# EAGLE design dual_encoder_shield_3v_reve (EAGLE 9.6.2)
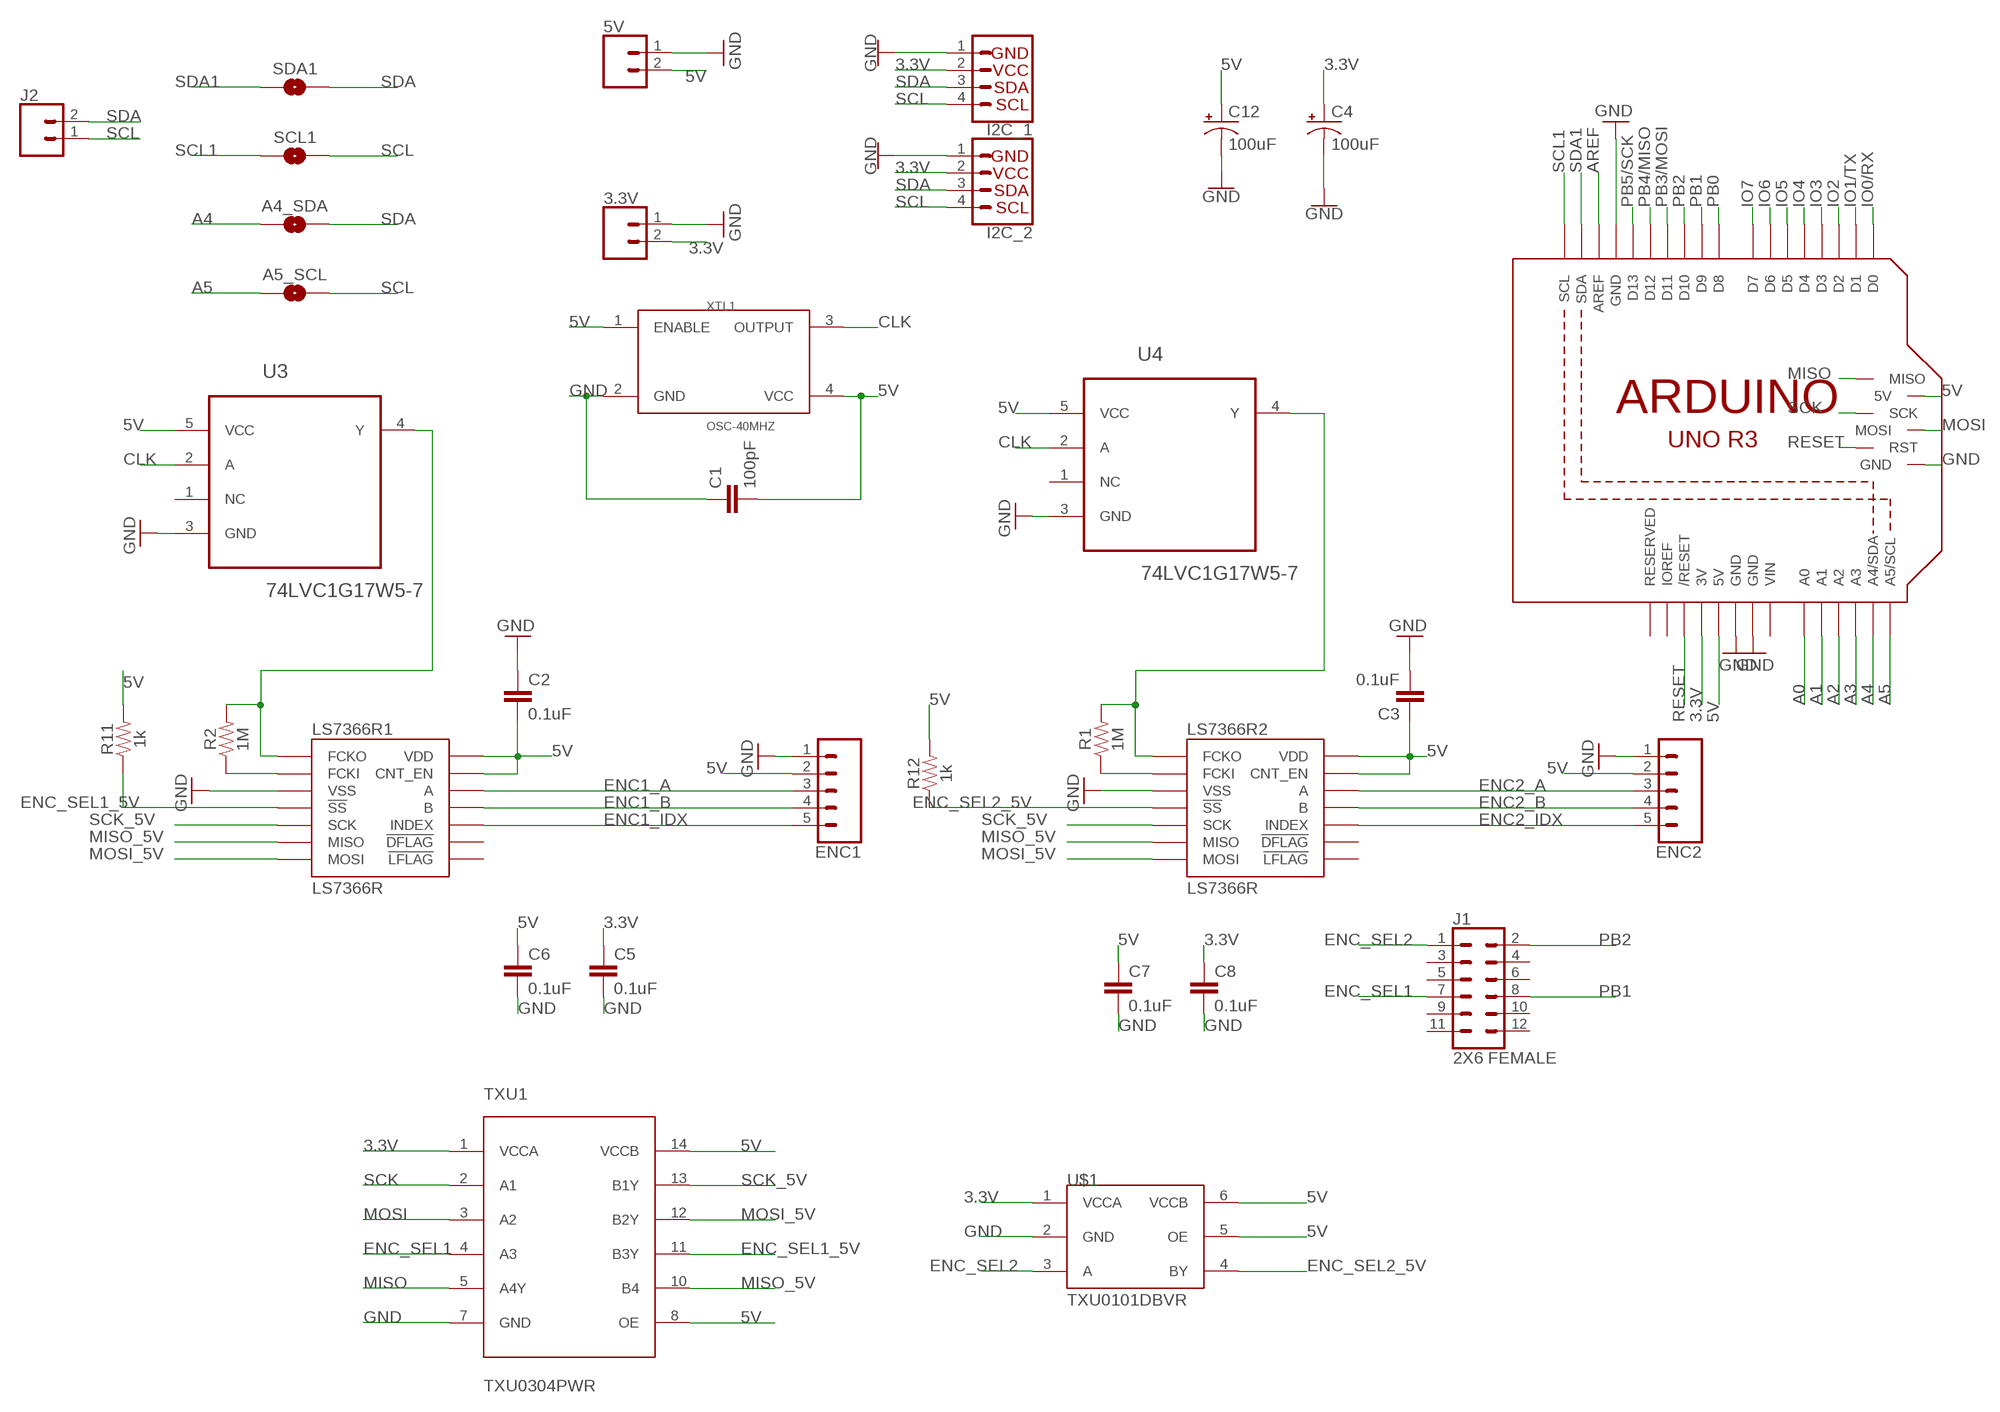
[diagram p0: schematic, sheet 1]

## Parts
3.3V  CONN_02-JST-2MM-SMT  [JST-2-SMD]
5V  CONN_02-JST-2MM-SMT  [JST-2-SMD]
A4_SDA  JUMPER-SMT_2_NO_NO-SILK  [SMT-JUMPER_2_NO_NO-SILK]
A5_SCL  JUMPER-SMT_2_NO_NO-SILK  [SMT-JUMPER_2_NO_NO-SILK]
C1  100pF  100PF-0603-50V-5%  [0603]
C2  0.1uF  0.1UF-0603-25V-5%  [0603]
C3  0.1uF  0.1UF-0603-25V-5%  [0603]
C4  100uF  100UF-POLAR-25V-20%(ELEC)  [PANASONIC_D]
C5  0.1uF  0.1UF-0603-25V-5%  [0603]
C6  0.1uF  0.1UF-0603-25V-5%  [0603]
C7  0.1uF  0.1UF-0603-25V-5%  [0603]
C8  0.1uF  0.1UF-0603-25V-5%  [0603]
C12  100uF  100UF-POLAR-25V-20%(ELEC)  [PANASONIC_D]
ENC1  CONN_05  [1X05]
ENC2  CONN_05  [1X05]
I2C_1  QWIIC_CONNECTORJS-1MM  [JST04_1MM_RA]
I2C_2  QWIIC_CONNECTORJS-1MM  [JST04_1MM_RA]
J1  2X6 FEMALE  CONN_06X2PTH_FEMALE  [2X6]
J2  CONN_02  [1X02]
LS7366R1  LS7366R  [SOIC14]
LS7366R2  LS7366R  [SOIC14]
M1  ARDUINO_R3_ICSP  [ARDUINOR3_ICSP]
R1  1M  1MOHM-0603-1/4W-5%  [0603]
R2  1M  1MOHM-0603-1/4W-5%  [0603]
R11  1k  1KOHM-0603-1/10W-1%  [0603]
R12  1k  1KOHM-0603-1/10W-1%  [0603]
SCL1  JUMPER-SMT_2_NO_NO-SILK  [SMT-JUMPER_2_NO_NO-SILK]
SDA1  JUMPER-SMT_2_NO_NO-SILK  [SMT-JUMPER_2_NO_NO-SILK]
TXU1  TXU0304PWR  [SOP65P640X95-14N]
U3  74LVC1G17W5-7  [SOT95P280X145-5N]
U4  74LVC1G17W5-7  [SOT95P280X145-5N]
U$1  TXU0101DBVR  [SOT23-6]
XTL1  OSC-40MHZ  [OSC_CB3LV-5I-50M000000]

## Nets
3.3V: 3.3V.2 C4.+ C5.1 C8.1 I2C_1.2 I2C_2.2 M1.3V TXU1.1(VCCA) U$1.1(VCCA)
5V: 5V.2 C1.2 C2.2 C3.1 C6.1 C7.1 C12.+ ENC1.2 ENC2.2 LS7366R1.13(CNT_EN) LS7366R1.14(VDD) LS7366R2.13(CNT_EN) LS7366R2.14(VDD) M1.5V M1.5V_ICSP(5V) R11.2 R12.2 TXU1.8(OE) TXU1.14(VCCB) U3.5(VCC) U4.5(VCC) U$1.5(OE) U$1.6(VCCB) XTL1.1(ENABLE) XTL1.4(VCC)
A0: M1.A0
A1: M1.A1
A2: M1.A2
A3: M1.A3
A4: A4_SDA.1 M1.A4(A4/SDA)
A5: A5_SCL.1 M1.A5(A5/SCL)
AREF: M1.AREF
CLK: U3.2(A) U4.2(A) XTL1.3(OUTPUT)
ENC1_A: ENC1.3 LS7366R1.12(A)
ENC1_B: ENC1.4 LS7366R1.11(B)
ENC1_IDX: ENC1.5 LS7366R1.10(INDEX)
ENC2_A: ENC2.3 LS7366R2.12(A)
ENC2_B: ENC2.4 LS7366R2.11(B)
ENC2_IDX: ENC2.5 LS7366R2.10(INDEX)
ENC_SEL1: J1.7 TXU1.4(A3)
ENC_SEL1_5V: LS7366R1.4(!SS) R11.1 TXU1.11(B3Y)
ENC_SEL2: J1.1 U$1.3(A)
ENC_SEL2_5V: LS7366R2.4(!SS) R12.1 U$1.4(BY)
GND: 3.3V.1 5V.1 C1.1 C2.1 C3.2 C4.- C5.2 C6.2 C7.2 C8.2 C12.- ENC1.1 ENC2.1 I2C_1.1 I2C_2.1 LS7366R1.3(VSS) LS7366R2.3(VSS) M1.GND M1.GND@1(GND) M1.GND@2(GND) M1.GND@3(GND) TXU1.7(GND) U3.3(GND) U4.3(GND) U$1.2(GND) XTL1.2(GND)
IO0/RX: M1.D0
IO1/TX: M1.D1
IO2: M1.D2
IO3: M1.D3
IO4: M1.D4
IO5: M1.D5
IO6: M1.D6
IO7: M1.D7
MISO: M1.MISO TXU1.5(A4Y)
MISO_5V: LS7366R1.6(MISO) LS7366R2.6(MISO) TXU1.10(B4)
MOSI: M1.MOSI TXU1.3(A2)
MOSI_5V: LS7366R1.7(MOSI) LS7366R2.7(MOSI) TXU1.12(B2Y)
N$6: LS7366R1.2(FCKI) R2.1
N$8: LS7366R2.1(FCKO) R1.2 U4.4(Y)
N$9: LS7366R2.2(FCKI) R1.1
N$10: LS7366R1.1(FCKO) R2.2 U3.4(Y)
PB0: M1.D8
PB1: J1.8 M1.D9
PB2: J1.2 M1.D10
PB3/MOSI: M1.D11
PB4/MISO: M1.D12
PB5/SCK: M1.D13
RESET: M1.RESET(/RESET) M1.RESET_ICSP(RST)
SCK: M1.SCK TXU1.2(A1)
SCK_5V: LS7366R1.5(SCK) LS7366R2.5(SCK) TXU1.13(B1Y)
SCL: A5_SCL.2 I2C_1.4 I2C_2.4 J2.1 SCL1.2
SCL1: M1.SCL SCL1.1
SDA: A4_SDA.2 I2C_1.3 I2C_2.3 J2.2 SDA1.2
SDA1: M1.SDA SDA1.1
Unconnected: J1.3 J1.4 J1.5 J1.6 J1.9 J1.10 J1.11 J1.12 LS7366R1.8(!LFLAG) LS7366R1.9(!DFLAG) LS7366R2.8(!LFLAG) LS7366R2.9(!DFLAG) M1.IOREF M1.RESERVED U3.1(NC) U4.1(NC)

## Power pins joined to a net without a drawn wire
VIN: M1.VIN

## Library data of the parts
3.3V 5V = SparkFun-Connectors:CONN_02: Multi connection point. Often used as Generic Header-pin footprint for 0.1 inch spaced/style header connections On any of the 0.1 inch spaced packages, you can populate with these: Break Away Headers - Straight <https://www.sparkfun.com/products/116> (PRT-00116) Break Away Male Headers - Right Angle <https://www.sparkfun.com/products/553> (PRT-00553) Female Headers <https://www.sparkfun.com/products/115> (PRT-00115) Break Away Headers - Machine Pin <https://www.sparkfun.com/products/117> (PRT-00117) Break Away Female Headers - Swiss Machine Pin <https://www.sparkfun.com/products/743> (PRT-00743) For SCREWTERMINALS and SPRING TERMINALS visit here: Screw Terimnals on SparkFun.com <https://www.sparkfun.com/search/results?term=Screw+Terminals> (5mm/3.5mm/2.54mm spacing) This device is also useful as a general connection point to wire up your design to another part of your project. Our various solder wires solder well into these plated through hole pads. Hook-Up Wire - Assortment (Stranded, 22 AWG) <https://www.sparkfun.com/products/11375> (PRT-11375) Hook-Up Wire - Assortment (Solid Core, 22 AWG) <https://www.sparkfun.com/products/11367> (PRT-11367) View the entire wire category on our website here <https://www.sparkfun.com/categories/141> Special notes: Molex polarized connector foot print use with: PRT-08233 with associated crimp pins and housings. 2.54_SCREWTERM for use with PRT-10571. 3.5mm Screw Terminal footprints for PRT-08084 5mm Screw Terminal footprints for use with PRT-08432; PROD_ID: CONN-11443
A4_SDA A5_SCL SCL1 SDA1 = SparkFun-Jumpers:JUMPER-SMT_2_NO: Normally open jumper This jumper has two pads in close proximity to each other. Apply solder to close the connection. Round pads are easier to solder for beginners, but are a lot larger. SparkFun Product that uses the round pads: SparkFun EL Sequencer <https://www.sparkfun.com/products/12781>
C1 = SparkFun-Capacitors:100PF: 100pF/0.1nF ceramic capacitors A capacitor is a passive two-terminal electrical component used to store electrical energy temporarily in an electric field.; PROD_ID: CAP-07883
C2 C3 C5-C8 = SparkFun-Capacitors:0.1UF: 0.1µF ceramic capacitors A capacitor is a passive two-terminal electrical component used to store electrical energy temporarily in an electric field.; PROD_ID: CAP-08604
C4 C12 = SparkFun-Capacitors:100UF-POLAR: 100µF polarized capacitors A capacitor is a passive two-terminal electrical component used to store electrical energy temporarily in an electric field.; PROD_ID: CAP-12547
ENC1 ENC2 = SparkFun-Connectors:CONN_05: Multi connection point. Often used as Generic Header-pin footprint for 0.1 inch spaced/style header connections On any of the 0.1 inch spaced packages, you can populate with these: Break Away Headers - Straight <https://www.sparkfun.com/products/116> (PRT-00116) Break Away Male Headers - Right Angle <https://www.sparkfun.com/products/553> (PRT-00553) Female Headers <https://www.sparkfun.com/products/115> (PRT-00115) Break Away Headers - Machine Pin <https://www.sparkfun.com/products/117> (PRT-00117) Break Away Female Headers - Swiss Machine Pin <https://www.sparkfun.com/products/743> (PRT-00743) For SCREWTERMINALS and SPRING TERMINALS visit here: Screw Terimnals on SparkFun.com <https://www.sparkfun.com/search/results?term=Screw+Terminals> (5mm/3.5mm/2.54mm spacing) This device is also useful as a general connection point to wire up your design to another part of your project. Our various solder wires solder well into these plated through hole pads. Hook-Up Wire - Assortment (Stranded, 22 AWG) <https://www.sparkfun.com/products/11375> (PRT-11375) Hook-Up Wire - Assortment (Solid Core, 22 AWG) <https://www.sparkfun.com/products/11367> (PRT-11367) View the entire wire category on our website here <https://www.sparkfun.com/categories/141> Special notes: Molex polarized connector foot print use with SKU : PRT-08231 with associated crimp pins and housings. 1MM SMD Version SKU: PRT-10208
I2C_1 I2C_2 = SparkFun-Connectors:QWIIC_CONNECTOR: SparkFun I2C Standard Qwiic Connector An SMD 1mm pitch JST connector makes it easy and quick (get it? Qwiic?) to connect I2C devices to each other. The Qwiic system <http://www.sparkfun.com/qwiic> enables fast and solderless connection between popular platforms and various sensors and actuators. We carry 200mm <https://www.sparkfun.com/products/14204>, 100mm <https://www.sparkfun.com/products/14205>, 50mm <https://www.sparkfun.com/products/14206>, and breadboard friendly <https://www.sparkfun.com/products/14207> Qwiic cables. We also offer 10 pcs strips <https://www.sparkfun.com/products/14323> the SMD connectors.; PROD_ID: CONN-13694
J1 = SparkFun-Connectors:CONN_06X2: Multi connection point. Often used as Generic Header-pin footprint for 0.1 inch spaced/style header connections On any of the 0.1 inch spaced packages, you can populate with these: Break Away Headers - Straight <https://www.sparkfun.com/products/116> (PRT-00116) Break Away Male Headers - Right Angle <https://www.sparkfun.com/products/553> (PRT-00553) Female Headers <https://www.sparkfun.com/products/115> (PRT-00115) Break Away Headers - Machine Pin <https://www.sparkfun.com/products/117> (PRT-00117) Break Away Female Headers - Swiss Machine Pin <https://www.sparkfun.com/products/743> (PRT-00743); PROD_ID: CONN-12423
J2 = SparkFun-Connectors:CONN_02: Multi connection point. Often used as Generic Header-pin footprint for 0.1 inch spaced/style header connections On any of the 0.1 inch spaced packages, you can populate with these: Break Away Headers - Straight <https://www.sparkfun.com/products/116> (PRT-00116) Break Away Male Headers - Right Angle <https://www.sparkfun.com/products/553> (PRT-00553) Female Headers <https://www.sparkfun.com/products/115> (PRT-00115) Break Away Headers - Machine Pin <https://www.sparkfun.com/products/117> (PRT-00117) Break Away Female Headers - Swiss Machine Pin <https://www.sparkfun.com/products/743> (PRT-00743) For SCREWTERMINALS and SPRING TERMINALS visit here: Screw Terimnals on SparkFun.com <https://www.sparkfun.com/search/results?term=Screw+Terminals> (5mm/3.5mm/2.54mm spacing) This device is also useful as a general connection point to wire up your design to another part of your project. Our various solder wires solder well into these plated through hole pads. Hook-Up Wire - Assortment (Stranded, 22 AWG) <https://www.sparkfun.com/products/11375> (PRT-11375) Hook-Up Wire - Assortment (Solid Core, 22 AWG) <https://www.sparkfun.com/products/11367> (PRT-11367) View the entire wire category on our website here <https://www.sparkfun.com/categories/141> Special notes: Molex polarized connector foot print use with: PRT-08233 with associated crimp pins and housings. 2.54_SCREWTERM for use with PRT-10571. 3.5mm Screw Terminal footprints for PRT-08084 5mm Screw Terminal footprints for use with PRT-08432
LS7366R1 LS7366R2 = LS7366R:LS7366R; AVAILABILITY: Unavailable; MF: LSI; MP: LS7366R; PACKAGE: None; PRICE: None
M1 = adafruit:ARDUINO_R3_ICSP
R1 R2 = SparkFun-Resistors:1MOHM: 1MΩ resistor A resistor is a passive two-terminal electrical component that implements electrical resistance as a circuit element. Resistors act to reduce current flow, and, at the same time, act to lower voltage levels within circuits. - Wikipedia; PROD_ID: RES-07868
R11 R12 = SparkFun-Resistors:1KOHM: 1kΩ resistor A resistor is a passive two-terminal electrical component that implements electrical resistance as a circuit element. Resistors act to reduce current flow, and, at the same time, act to lower voltage levels within circuits. - Wikipedia; PROD_ID: RES-07856
TXU1 = steveo:TXU0304PWR
U3 U4 = 74LVC1G17W5-7:74LVC1G17W5-7: SCHMITT-TRIGGER INVERETER; DESCRIPTION: Buffer, Non-Inverting 1 Element 1 Bit per Element Push-Pull Output SOT-25; DIGI-KEY_PART_NUMBER: 74LVC1G17W5-7TR-ND; MF: Diodes Inc.; MP: 74LVC1G17W5-7; PACKAGE: SOT-753 Diodes Inc.; PURCHASE-URL: https://pricing.snapeda.com/search/part/74LVC1G17W5-7/?ref=eda
U$1 = steveo:TXU0101DBVR
XTL1 = steveo:OSC-40MHZ

## Board
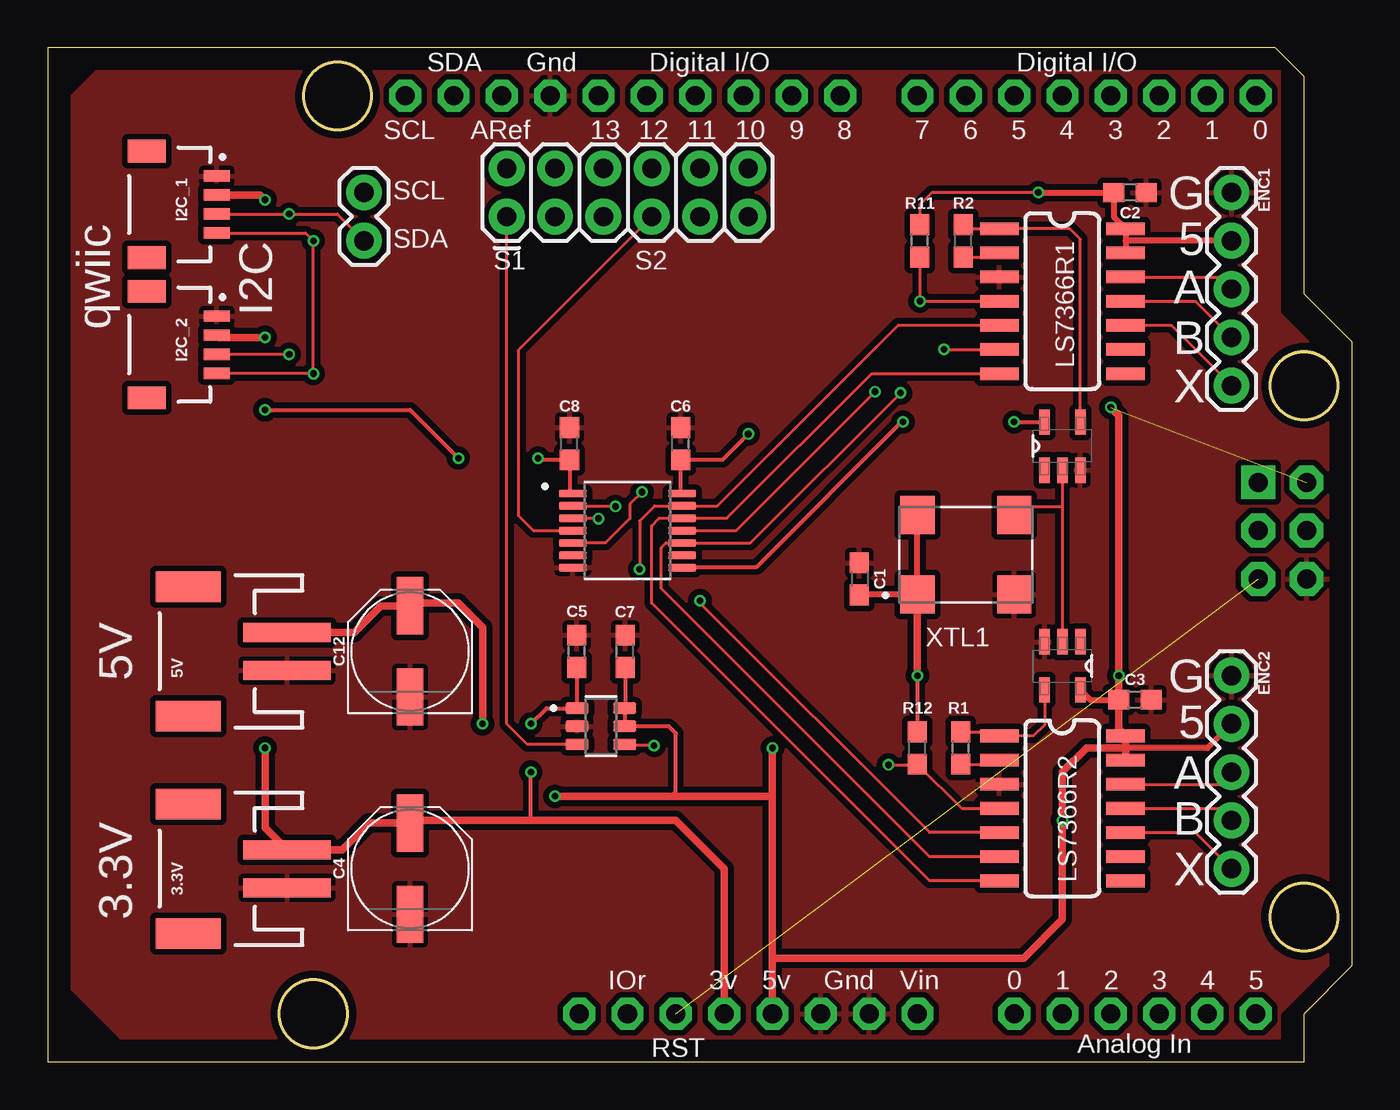
[diagram p1: board, top side]
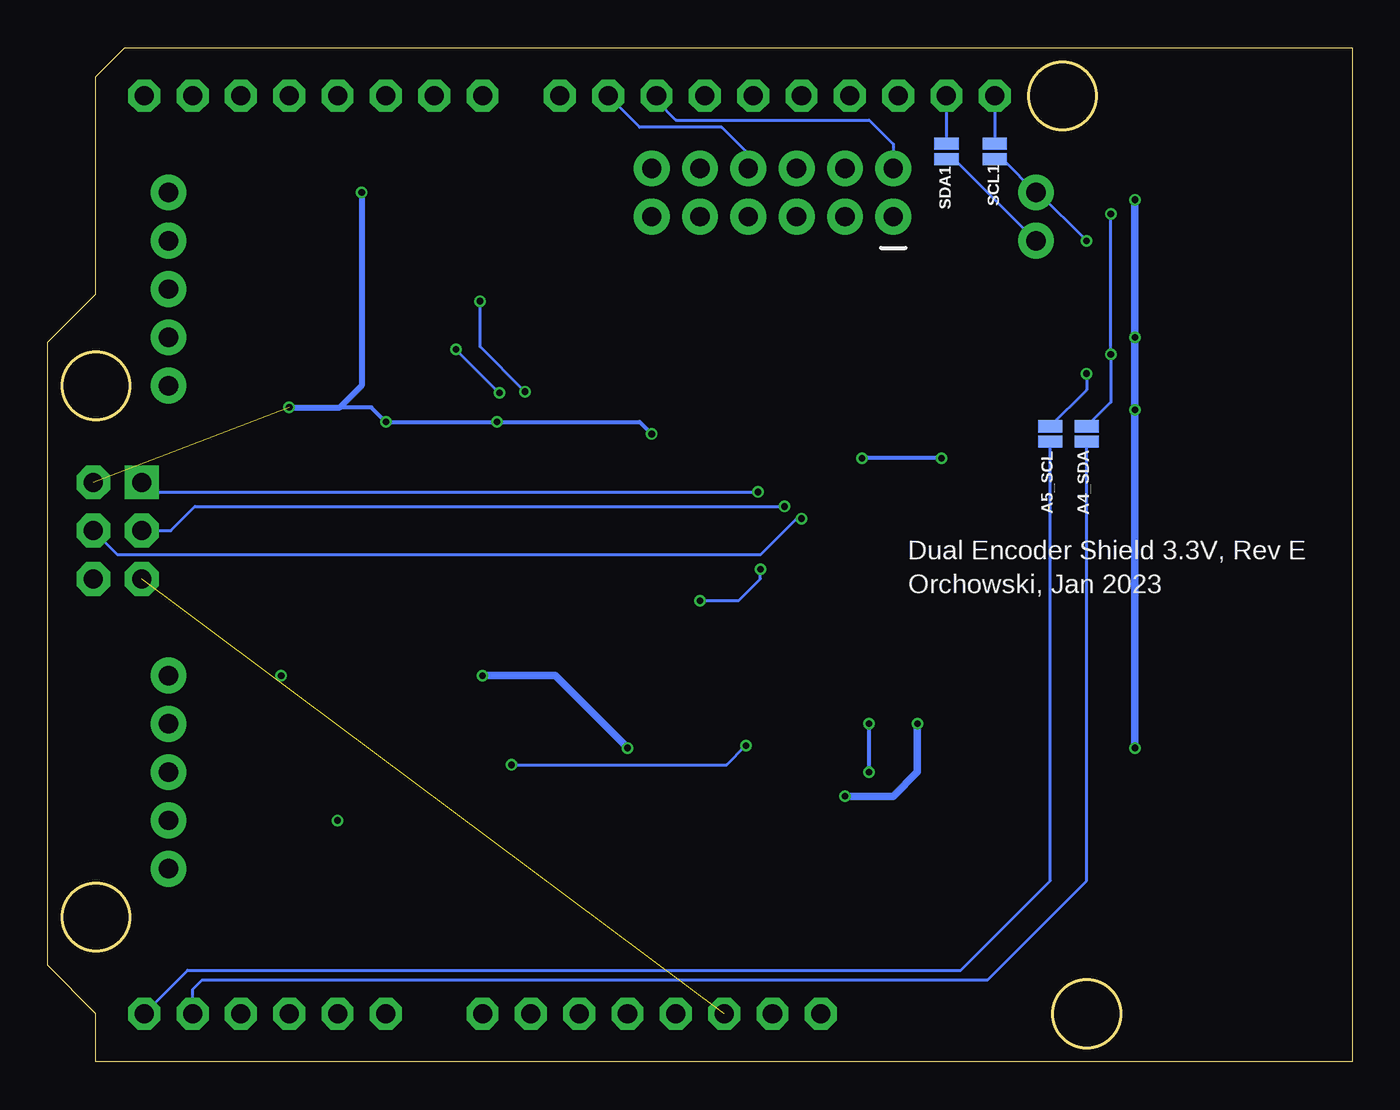
[diagram p2: board, bottom side, seen from below]

Size 55.65 x 51.82 mm. Coordinates in mm from the lower left corner, seen from the top.
Outline: circle at 3.07,50.06 radius 1.77
Outline: circle at 53.87,34.82 radius 1.78
Outline: circle at 53.87,6.88 radius 1.78
Outline: circle at 1.8,1.8 radius 1.8
Copper layers (1*16): Top 0.035559375mm / dielectric 1.6mm / Bottom 0.035559375mm
Design rules "oshpark-2layer": minimum track width 6mil, minimum drill 10mil, track to track 6mil, track to pad 6mil, pad to pad 6mil, via to via 6mil, smd to smd 6mil, copper to edge 15mil, drill to drill 6mil, minimum pad ring 5mil, minimum via ring 5mil, stop-mask expansion 2.5mil, vias tented up to drill 0mil, thermal gap 10mil

### Footprints (pad centres in the part's own frame; a part is rotated, then mirrored left to right if it is on the bottom)
JST-2-SMD = smd 1 x 4.6: 1 -1,-3.7; 2 1,-3.7 | smd 1.6 x 3.4: NC1 -3.4,1.5; NC2 3.4,1.5
SMT-JUMPER_2_NO_NO-SILK = smd 0.635 x 1.27: 1 -0.406,0; 2 0.406,0
0603 = smd 1.1 x 1: 1 -0.85,0; 2 0.85,0
PANASONIC_D = smd 3 x 1.4: + 2.4,0; - -2.4,0
1X05 = drill 1.016 pad 1.88: 1 0,0; 2 2.54,0; 3 5.08,0; 4 7.62,0; 5 10.16,0
JST04_1MM_RA = smd 0.6 x 1.35: 1 -1.5,0; 2 -0.5,0; 3 0.5,0; 4 1.5,0 | smd 1.2 x 2: NC1 2.8,-3.675; NC2 -2.8,-3.675
2X6 = drill 1.016 pad 1.88: 1 0,0; 2 0,2.54; 3 2.54,0; 4 2.54,2.54; 5 5.08,0; 6 5.08,2.54; 7 7.62,0; 8 7.62,2.54; 9 10.16,0; 10 10.16,2.54; 11 12.7,0; 12 12.7,2.54
1X02 = drill 1.016 pad 1.88: 1 0,0; 2 2.54,0
SOIC14 = smd 2.032 x 0.66: 1 -3.315,4.445; 2 -3.315,3.175; 3 -3.315,1.905; 4 -3.315,0.635; 5 -3.315,-0.635; 6 -3.315,-1.905; 7 -3.315,-3.175; 8 3.315,-3.175; 9 3.315,-1.905; 10 3.315,-0.635; 11 3.315,0.635; 12 3.315,1.905; 13 3.315,3.175; 14 3.315,4.445
ARDUINOR3_ICSP = drill 1 pad 1.676 octagon: 3V 35.56,2.54; 5V 38.1,2.54; A0 50.8,2.54; A1 53.34,2.54; A2 55.88,2.54; A3 58.42,2.54; A4 60.96,2.54; A5 63.5,2.54; AREF 23.876,50.8; D0 63.5,50.8; D1 60.96,50.8; D2 58.42,50.8; D3 55.88,50.8; D4 53.34,50.8; D5 50.8,50.8; D6 48.26,50.8; D7 45.72,50.8; D8 41.656,50.8; D9 39.116,50.8; D10 36.576,50.8; D11 34.036,50.8; D12 31.496,50.8; D13 28.956,50.8; GND 26.416,50.8; GND@1 43.18,2.54; GND@2 40.64,2.54; IOREF 30.48,2.54; RESERVED 27.94,2.54; RESET 33.02,2.54; SCL 18.796,50.8; SDA 21.336,50.8; VIN 45.72,2.54 | drill 1 pad 1.778 octagon: 5V_ICSP 66.167,30.48; GND@3 66.167,25.4; MOSI 66.167,27.94; RESET_ICSP 63.627,25.4; SCK 63.627,27.94 | drill 1 pad 1.778 square: MISO 63.627,30.48
SOP65P640X95-14N = smd 1.47 x 0.38: 1 -2.87,1.95; 2 -2.87,1.3; 3 -2.87,0.65; 4 -2.87,0; 5 -2.87,-0.65; 6 -2.87,-1.3; 7 -2.87,-1.95; 8 2.87,-1.95; 9 2.87,-1.3; 10 2.87,-0.65; 11 2.87,0; 12 2.87,0.65; 13 2.87,1.3; 14 2.87,1.95
SOT95P280X145-5N = smd 1.321 x 0.559: 1 -1.27,0.94; 2 -1.27,0; 3 -1.27,-0.94; 4 1.27,-0.94; 5 1.27,0.94
SOT23-6 = smd 1.21 x 0.58: 1 -1.255,0.95; 2 -1.255,0; 3 -1.255,-0.95; 4 1.255,-0.95; 5 1.255,0; 6 1.255,0.95
OSC_CB3LV-5I-50M000000 = smd 1.8 x 2: 1 -2.54,-2.1; 2 2.54,-2.1; 3 2.54,2.1; 4 -2.54,2.1

### Placement (x,y rotation side)
3.3V  -3.28,9.42 90 top
5V  -3.28,20.85 90 top
A4_SDA  1.8,32.28 90 bottom
A5_SCL  3.7,32.28 90 bottom
C1  30.5,24.66 270 top
C2  44.72,44.98 180 top
C3  44.98,18.31 0 top
C4  6.88,9.42 90 top
C5  15.64,20.85 90 top
C6  21.1,31.77 90 top
C7  18.18,20.85 90 top
C8  15.26,31.77 90 top
C12  6.88,20.85 90 top
ENC1  50.06,44.98 270 top
ENC2  50.06,19.58 270 top
I2C_1  -3.28,44.34 270 top  (outside the outline)
I2C_2  -3.28,36.98 270 top  (outside the outline)
J1  11.96,43.71 0 top
J2  4.46,44.98 270 top
LS7366R1  41.17,38.63 0 top
LS7366R2  41.17,11.96 0 top
M1  -12.17,-0.74 0 top
R1  35.83,15.77 90 top
R2  35.96,42.44 90 top
R11  33.67,42.44 90 top
R12  33.55,15.77 90 top
SCL1  6.62,47.14 270 bottom
SDA1  9.16,47.14 270 bottom
TXU1  18.31,27.2 0 top
U3  41.17,31.64 90 top
U4  41.17,20.08 270 top
U$1  16.91,16.91 0 top
XTL1  36.09,25.93 0 top

### Tracks (layer width: path | path; a pad name or v marks a point on that pad's centre or on a via)
3.3V  (via drill 0.35)
  Top 0.203: TXU1.1 15.26,29.32 C8.1 13.7,30.92 v13.61,31.01 | v-0.74,33.55 6.88,33.55 v9.42,31.01 | 13.23,11.96 v13.23,14.5 | v13.23,17.04 14.05,17.86 U$1.1 15.65,19.98 C5.1
  Top 0.406: M1.3V 23.39,9.42 20.85,11.96 13.23,11.96 7.02,11.96 C4.+ 4.7,11.82 3.3,10.42 3.3V.2 -0.74,11.58 v-0.74,15.77 | v-0.74,37.36 -3.16,37.36 I2C_2.2 | v-0.74,44.6 -0.99,44.84 I2C_1.2
  Bottom 0.203: v9.42,31.01 v13.61,31.01 | v13.23,14.5 v13.23,17.04
  Bottom 0.406: v-0.74,15.77 v-0.74,33.55 v-0.74,37.36 v-0.74,44.6
5V  (via drill 0.35)  (1 unrouted)
  Top 0.152: v39.9,44.98 34.31,44.98 33.67,44.34 R11.2 | C7.1 18.35,20 | 30.46,23.85 C1.2
  Top 0.203: 33.55,23.89 XTL1.1 | TXU1.14 21.1,29.22 C6.1 23.3,30.92 v24.66,32.28 | 30.48,23.83 30.46,23.85 | TXU1.8 21.22,25.29 25.09,25.29 32.71,32.91 v32.78,32.91 | C7.1 18.18,17.87 U$1.6 U$1.5 20.47,16.91 20.85,16.53 20.85,13.23 20.72,13.35 | v38.63,32.91 U3.5 | v33.55,19.58 R12.2
  Top 0.305: U4.5 42.61,18.31 C3.1 | 44.48,42.44 LS7366R1.14 43.87,43.68 C2.2 v39.9,44.98 | 44.48,42.44 LS7366R1.13 | ENC1.2 44.48,42.44 | ENC2.2 48.79,15.77 44.48,15.77 | XTL1.4 XTL1.1 30.52,23.83 C1.2
  Top 0.406: M1.5V 25.93,4.72 | 25.93,4.72 39.13,4.72 41.17,6.75 v41.17,11.96 41.17,14.5 42.44,15.77 44.48,15.77 | 44.48,15.77 LS7366R2.14 44.13,16.76 C3.1 v44.13,19.58 44.13,33.25 v43.71,33.67 | 44.48,15.77 LS7366R2.13 | v10.69,17.04 10.69,22.12 9.42,23.39 7.02,23.39 C12.+ 5.34,23.25 3.94,21.85 5V.2 | v33.55,19.58 33.55,23.89 | 25.93,13.23 20.85,13.23 v14.5,13.23 | 25.93,13.23 v25.93,15.77 | 25.93,4.72 25.93,13.23
  Bottom 0.203: v24.66,32.28 25.29,32.91 v32.78,32.91 v38.63,32.91 39.39,33.67 41.04,33.67
  Bottom 0.305: v39.9,44.98 39.9,34.82 41.04,33.67 v43.71,33.67
  Bottom 0.406: v14.5,13.23 11.96,13.23 10.69,14.5 v10.69,17.04 | v25.93,15.77 29.74,19.58 v33.55,19.58
A4
  Bottom 0.152: M1.A4 48.79,3.07 48.28,3.57 7,3.57 1.8,8.78 A4_SDA.1
A5
  Bottom 0.152: M1.A5 49.04,4.08 8.4,4.08 3.7,8.78 A5_SCL.1
CLK
  Top 0.152: XTL1.3 39.07,28.47 41.17,28.47 | U3.2 41.17,28.47 | 41.17,28.47 U4.2
ENC1_A
  Top 0.152: LS7366R1.12 49.42,40.53 ENC1.3
ENC1_B
  Top 0.152: LS7366R1.11 48.15,39.26 ENC1.4
ENC1_IDX
  Top 0.152: LS7366R1.10 46.88,37.99 ENC1.5
ENC2_A
  Top 0.152: LS7366R2.12 49.42,13.86 ENC2.3
ENC2_B
  Top 0.152: LS7366R2.11 49.42,12.59 ENC2.4
ENC2_IDX
  Top 0.152: LS7366R2.10 48.15,11.32 ENC2.5
ENC_SEL1
  Top 0.152: J1.7 12.59,36.72 12.59,27.96 13.35,27.2 TXU1.4
ENC_SEL1_5V  (via drill 0.35)
  Top 0.152: LS7366R1.4 v33.67,39.26 R11.1 | v31.32,34.5 24.01,27.2 TXU1.11
  Bottom 0.152: v31.32,34.5 33.67,36.86 v33.67,39.26
ENC_SEL2
  Top 0.152: U$1.3 13.03,15.96 11.96,17.04 J1.1
ENC_SEL2_5V  (via drill 0.35)
  Top 0.152: v32.02,14.88 33.51,14.88 R12.1 35.87,12.59 LS7366R2.4 | v19.7,15.89 18.23,15.89 U$1.4
  Bottom 0.152: v32.02,14.88 20.72,14.88 v19.7,15.89
GND
  pour Top (isolate 0.305): -9.63,51.33 -10.9,50.06 -10.9,3.07 -8.36,0.53 52.6,0.53 52.6,1.8 55.14,4.34 55.14,36.09 52.6,38.63 52.6,51.33
MISO  (via drill 0.35)
  Top 0.152: v19.07,29.23 18.43,28.59 18.43,27.83 17.15,26.55 TXU1.5
  Bottom 0.152: M1.MISO 50.95,29.23 v19.07,29.23
MISO_5V  (via drill 0.35)
  Top 0.152: v34.94,36.72 LS7366R1.6 | v32.66,34.44 24.77,26.55 TXU1.10 20.32,26.55 20.08,26.31 20.08,24.15 34.18,10.05 LS7366R2.6
  Bottom 0.152: v32.66,34.44 v34.94,36.72
MOSI  (via drill 0.35)
  Top 0.152: v16.78,27.83 15.45,27.83 TXU1.3
  Bottom 0.152: M1.MOSI 52.72,25.93 18.94,25.93 17.04,27.83 v16.78,27.83
MOSI_5V
  Top 0.152: LS7366R1.7 31.13,35.45 23.53,27.85 TXU1.12 19.97,27.85 19.58,27.45 19.58,24.02 19.58,23.39 34.18,8.78 LS7366R2.7
N$6
  Top 0.152: R2.1 37.64,41.59 LS7366R1.2
N$8
  Top 0.152: R1.2 37.64,16.62 LS7366R2.1 39.64,16.4 40.23,16.99 U4.4
N$9
  Top 0.152: R1.1 37.64,14.92 LS7366R2.2
N$10
  Top 0.152: R2.2 36.17,43.07 LS7366R1.1 41.55,43.07 42.11,42.51 U3.4
PB1
  Bottom 0.152: J1.8 19.58,47.01 20.97,48.41 25.29,48.41 M1.D9
PB2
  Bottom 0.152: M1.D10 24.4,49.8 23.39,48.79 13.23,48.79 11.96,47.52 J1.2
RESET  (1 unrouted)
SCK  (via drill 0.35)
  Top 0.152: v17.67,28.47 15.47,28.47 TXU1.2
  Bottom 0.152: M1.SCK 49.93,27.2 48.66,28.47 v17.67,28.47
SCK_5V  (via drill 0.35)
  Top 0.152: LS7366R2.5 34.18,11.32 22.12,23.39 v22.12,23.51 | v18.94,25.16 18.94,27.7 19.73,28.5 TXU1.13 23.04,28.5 32.53,37.99 LS7366R1.5
  Bottom 0.152: v18.94,25.16 18.94,24.66 20.08,23.51 v22.12,23.51
SCL  (via drill 0.35)
  Top 0.152: I2C_2.4 -3.26,35.45 v1.8,35.45 v1.8,42.44 1.39,42.84 I2C_1.4
  Bottom 0.152: v1.8,35.45 1.8,34.59 A5_SCL.2 | SCL1.2 6.22,46.73 J2.1 4.34,44.98 v1.8,42.44
SCL1
  Bottom 0.152: M1.SCL SCL1.1
SDA  (via drill 0.35)
  Top 0.152: I2C_1.3 v0.53,43.84 3.06,43.84 J2.2 | I2C_2.3 v0.53,36.47
  Bottom 0.152: A4_SDA.2 0.53,33.95 v0.53,36.47 v0.53,43.84 | SDA1.2 8.76,46.73 J2.2
SDA1
  Bottom 0.152: M1.SDA SDA1.1

### Text on the board
tPlace: G | SCL | qwiic | 5 | SDA | S1 | S2 | A | I2C | B | X | G | 5V | 5 | A | B | X | 3.3V
bPlace: Dual Encoder Shield 3.3V, Rev E | Orchowski, Jan 2023